# EAGLE design untitled (EAGLE 9.6.2)
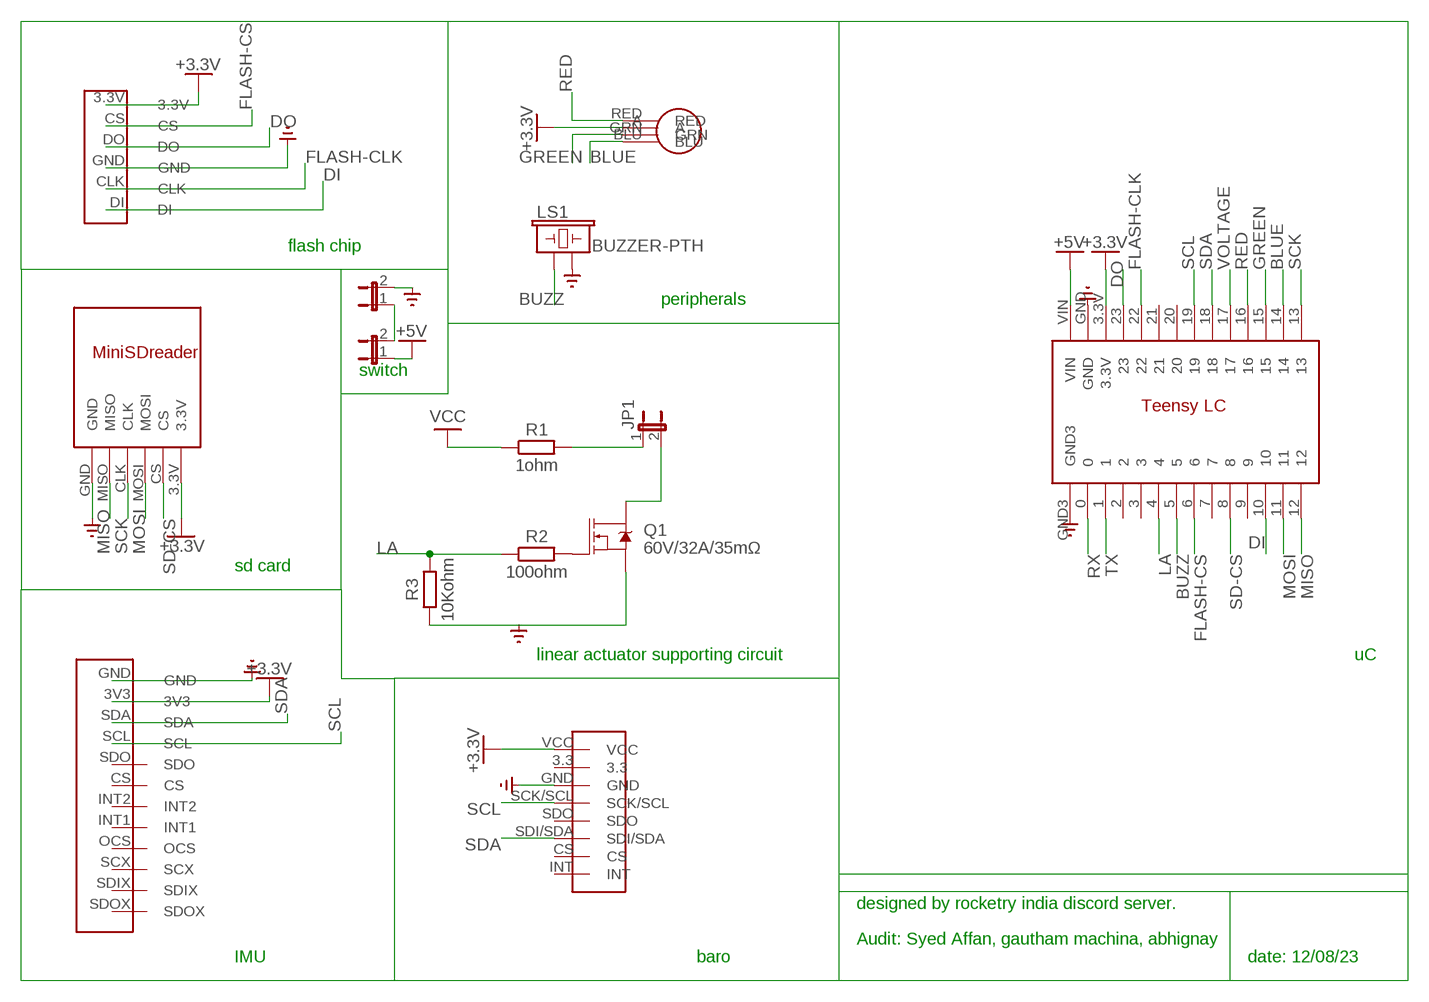
[diagram p0: schematic, sheet 1]

## Parts
JP1  JP1E  [JP1]
JP2  JP1E  [JP1]
JP3  JP1E  [JP1]
LS1  BUZZER-PTH  [BUZZER-12MM]
Q1  60V/32A/35mΩ  MOSFET-NCH-FQP30N06L  [TO220V]
R1  1ohm  R_AXIAL-7.2MM-PITCH  [RESAD724W46L381D178B]
R2  100ohm  R_AXIAL-7.2MM-PITCH  [RESAD724W46L381D178B]
R3  10Kohm  R_AXIAL-7.2MM-PITCH  [RESAD724W46L381D178B]
U$1  TEENSYLC  [TEENSYLC]
U$2  LED  [LED]
U$3  FLASH  [FLASH]
U$4  MINISDREADER  [MINISDREADER]
U$5  LSM6DSO  [LSM6DSO]
U$6  BMP390  [BMP390]

## Nets
+3.3V: U$1.3.3V U$2.A U$3.3.3V U$4.3.3V U$5.3V3 U$6.VCC
+5V: JP3.1 U$1.VIN
BLUE: U$1.14 U$2.BLU
BUZZ: LS1.+ U$1.5
DI: U$1.10 U$3.DI
DO: U$1.23 U$3.DO
FLASH-CLK: U$1.22 U$3.CLK
FLASH-CS: U$1.6 U$3.CS
GND: JP2.2 U$1.GND U$3.GND U$4.GND U$5.GND U$6.GND ; supply symbol labelled SUPPLY0_GND_
GREEN: U$1.15 U$2.GRN
LA: R2.1 R3.2 U$1.4
MISO: U$1.12 U$4.MISO
MOSI: U$1.11 U$4.MOSI
N$1: JP1.1 R1.2
N$2: JP1.2 Q1.2(D)
N$3: Q1.1(G) R2.2
N$5: Q1.3(S) R3.1
N$6: JP2.1 JP3.2
RED: U$1.16 U$2.RED
RX: U$1.0
SCK: U$1.13 U$4.CLK
SCL: U$1.19 U$5.SCL U$6.SCK/SCL
SD-CS: U$1.8 U$4.CS
SDA: U$1.18 U$5.SDA U$6.SDI/SDA
TX: U$1.1
VCC: R1.1
VOLTAGE: U$1.17
Unconnected: LS1.- U$1.2 U$1.3 U$1.7 U$1.9 U$1.20 U$1.21 U$1.GND3 U$5.CS U$5.INT1 U$5.INT2 U$5.OCS U$5.SCX U$5.SDIX U$5.SDO U$5.SDOX U$6.3.3 U$6.CS U$6.INT U$6.SDO

## Notes on the sheet
- flash chip
- peripherals
- switch
- sd card
- linear actuator supporting circuit | uC
- designed by rocketry india discord server.
- Audit: Syed Affan, gautham machina, abhignay
- IMU | baro | date: 12/08/23

## Library data of the parts
JP1-JP3 = jumper:JP1E: JUMPER
LS1 = SparkFun-Electromechanical:BUZZER: Buzzer Small round buzzers that operate around the audible 2kHz range. You can use these as speakers to create simple music or user interfaces. Variant Overview: PTH - Mini Speaker - PC Mount 12mm 2.048kHz <https://www.sparkfun.com/products/7950> PTH_KIT - Mini Speaker - PC Mount 12mm 2.048kHz <https://www.sparkfun.com/products/7950> KIT simplifies soldering by adding stop mask to one side of the pads. PTH_NO_SILK - Mini Speaker - PC Mount 12mm 2.048kHz <https://www.sparkfun.com/products/7950> No silkscreen indicator of buzzer outline. PTH_KIT_NO_SILK - Mini Speaker - PC Mount 12mm 2.048kHz <https://www.sparkfun.com/products/7950> KIT package w/o silkscreen SMD - Buzzer Audio Magnetic (CCV-084B16) SMD buzzer used on, e.g. the LilyPad Buzzer <https://www.sparkfun.com/products/8463> and RFID USB Reader <https://www.sparkfun.com/products/9963>. SMD_KIT - Buzzer Audio Magnetic (CCV-084B16) SMD Buzzer with elongated pins to make soldering easier. Used on the SparkFun Simon Says - Surface Mount Soldering Kit <https://www.sparkfun.com/products/10935>.; PROD_ID: COMP-08253; SF_SKU: COM-07950
Q1 = SparkFun-DiscreteSemi:MOSFET-NCH: N-channel MOSFETs Voltage controlled devices that allow control of high current outputs. SparkFun Products: SparkFun OpenScale <https://www.sparkfun.com/products/13261> SparkFun Digital Sandbox <https://www.sparkfun.com/products/12651> SparkFun Monster Moto Shield <https://www.sparkfun.com/products/10182> SparkFun MOSFET Power Controller <https://www.sparkfun.com/products/11214>; PROD_ID: TRANS-10060
R1-R3 = Resistor:R: Resistor Fixed - Generic; CATEGORY: Resistor; SUB-CATEGORY: Fixed
U$1 = Teensy lc:TEENSYLC
U$2 = led:LED
U$3 = flash:FLASH
U$4 = minisdreader:MINISDREADER
U$5 = LSM6DSO:LSM6DSO
U$6 = bmp390:BMP390

## Board
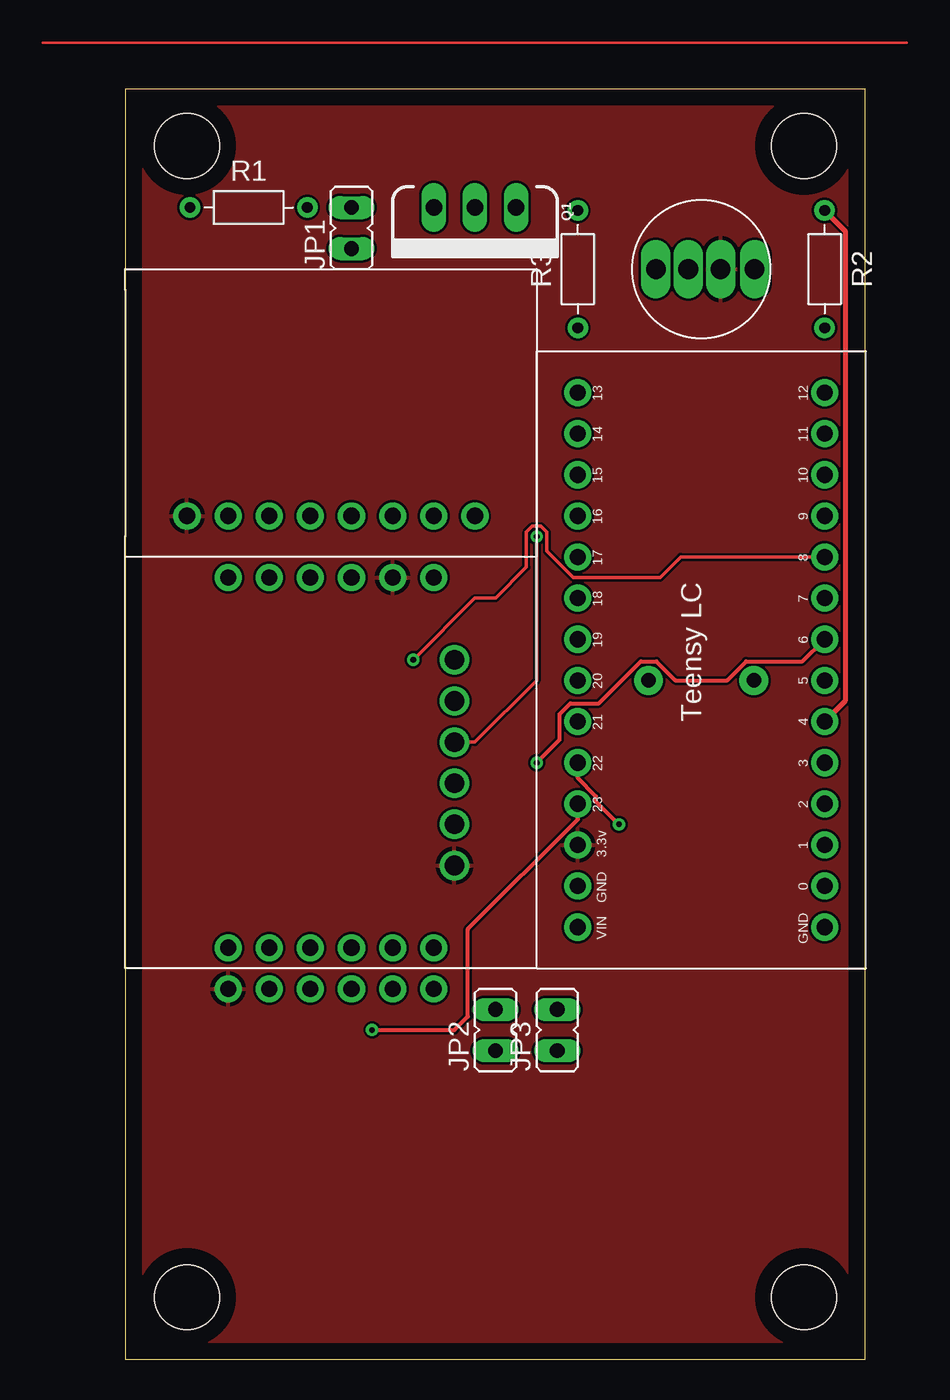
[diagram p1: board, top side]
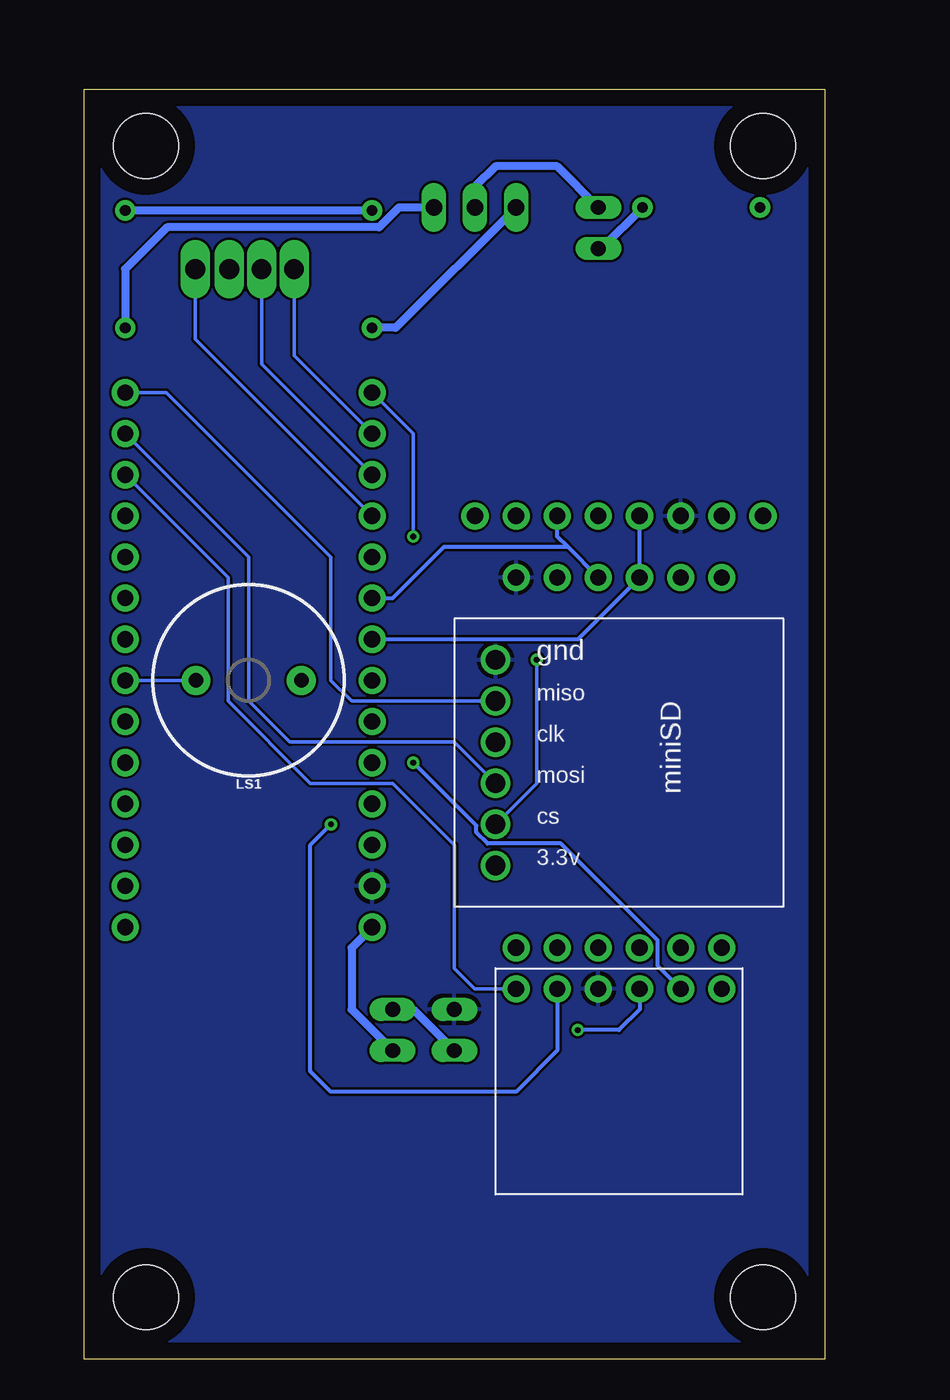
[diagram p2: board, bottom side, seen from below]

Size 45.7 x 78.41 mm. Coordinates in mm from the lower left corner, seen from the top.
Outline: 0,0 45.7,0 45.7,78.41 0,78.41 0,0
Copper layers (1*16): Top 0.035mm / dielectric 1.5mm / Bottom 0.035mm
Design rules "default": minimum track width 6mil, minimum drill 0.35mm, track to track 6mil, track to pad 6mil, pad to pad 6mil, via to via 6mil, smd to smd 6mil, copper to edge 40mil, drill to drill 6mil, minimum pad ring 10mil, minimum via ring 8mil, stop-mask expansion 4mil, vias tented up to drill 0mil, thermal gap 10mil
Holes 4 mm at 41.91,74.93 3.81,74.93 3.81,3.81 41.91,3.81

### Footprints (pad centres in the part's own frame; a part is rotated, then mirrored left to right if it is on the bottom)
JP1 = drill 0.914 long: 1 0,-1.27; 2 0,1.27
BUZZER-12MM = drill 0.9 pad 1.778: + 3.25,0; - -3.25,0
TO220V = drill 1.016 long: 1 -2.54,0; 2 0,0; 3 2.54,0
RESAD724W46L381D178B = drill 0.66 pad 1.26: 1 -3.62,0; 2 3.62,0
TEENSYLC = drill 1 pad 1.676: 0 5.08,0; 1 7.62,0; 2 10.16,0; 3 12.7,0; 3.3V 7.62,15.24; 4 15.24,0; 5 17.78,0; 6 20.32,0; 7 22.86,0; 8 25.4,0; 9 27.94,0; 10 30.48,0; 11 33.02,0; 12 35.56,0; 13 35.56,15.24; 14 33.02,15.24; 15 30.48,15.24; 16 27.94,15.24; 17 25.4,15.24; 18 22.86,15.24; 19 20.32,15.24; 20 17.78,15.24; 21 15.24,15.24; 22 12.7,15.24; 23 10.16,15.24; GND 5.08,15.24; GND3 2.54,0; VIN 2.54,15.24
LED = drill 1.212 pad 1.422 long: A -1.2,0; BLU 2.8,0; GRN 0.8,0; RED -3.3,0
FLASH = drill 1 pad 1.676: 3.3V 1.27,13.97; CLK 1.27,3.81; CS 1.27,11.43; DI 1.27,1.27; DO 1.27,8.89; GND 1.27,6.35
MINISDREADER = drill 1.212 pad 1.411: 3.3V 15.24,-17.78; CLK 7.62,-17.78; CS 12.7,-17.78; GND 2.54,-17.78; MISO 5.08,-17.78; MOSI 10.16,-17.78
LSM6DSO = drill 1 pad 1.676: 3V3 8.89,1.27; CS 19.05,1.27; GND 6.35,1.27; INT1 8.89,24.13; INT2 6.35,24.13; OCS 11.43,24.13; SCL 13.97,1.27; SCX 13.97,24.13; SDA 11.43,1.27; SDIX 16.51,24.13; SDO 16.51,1.27; SDOX 19.05,24.13
BMP390 = drill 1 pad 1.676: 3.3 6.35,-15.24; CS 19.05,-15.24; GND 8.89,-15.24; INT 21.59,-15.24; SCK/SCL 11.43,-15.24; SDI/SDA 16.51,-15.24; SDO 13.97,-15.24; VCC 3.81,-15.24

### Placement (x,y rotation side)
JP1  13.97,69.85 0 top
JP2  22.86,20.32 0 top
JP3  26.67,20.32 0 top
LS1  35.56,41.91 180 bottom
Q1  21.59,71.12 180 top
R1  7.62,71.12 0 top
R2  43.18,67.31 270 top
R3  27.94,67.31 90 top
U$1  43.18,24.13 90 top
U$2  35.56,67.31 180 top
U$3  20.32,24.13 270 bottom
U$4  2.54,45.72 270 bottom
U$5  25.4,49.53 180 top
U$6  0,67.31 0 top

### Tracks (layer width: path | path; a pad name or v marks a point on that pad's centre or on a via)
+3.3V
  pour Top: -5.08,80.01 48.26,80.01 48.26,-2.54 46.99,-3.81 -5.08,-3.81
+5V
  Bottom 0.508: U$1.VIN 29.21,25.4 29.21,21.59 JP3.1
BLUE
  Bottom 0.203: U$1.14 32.76,61.97 U$2.BLU
BUZZ
  Bottom 0.203: LS1.+ U$1.5
DI
  Bottom 0.203: U$1.10 36.83,48.26 36.83,40.64 31.75,35.56 26.67,35.56 22.86,31.75 22.86,24.13 21.59,22.86 U$3.DI
DO  (via drill 0.35)
  Top 0.254: v15.24,20.32 20.32,20.32 21.16,21.16 21.16,26.55 27.94,33.33 U$1.23
  Bottom 0.254: U$3.DO 11.43,21.59 12.7,20.32 v15.24,20.32
FLASH-CLK  (via drill 0.35)
  Top 0.254: v30.48,33.02 29.06,34.44 29.06,34.75 27.94,35.87 U$1.22
  Bottom 0.254: U$3.CLK 16.51,19.05 19.05,16.51 30.48,16.51 31.75,17.78 31.75,31.75 v30.48,33.02
FLASH-CS  (via drill 0.35)
  Top 0.254: v25.4,36.83 26.82,38.25 26.82,39.83 27.48,40.49 29.23,40.49 31.83,43.08 32.79,43.08 33.96,41.91 37.16,41.91 38.33,43.08 41.81,43.08 U$1.6
  Bottom 0.254: U$3.CS 10.31,24.28 10.31,25.86 16.28,31.83 20.81,31.83 21.51,32.53 21.51,32.94 v25.4,36.83
GND
  pour Bottom: -2.54,78.74 -2.54,-3.81 48.26,-3.81 48.26,78.74
GREEN
  Bottom 0.203: U$1.15 34.76,61.43 U$2.GRN
LA
  Top 0.305: R2.1 44.45,69.66 44.45,40.64 U$1.4
  Bottom 0.508: R3.2 R2.1
MISO
  Bottom 0.203: U$4.MISO 29.21,40.64 30.48,41.91 30.48,49.53 40.64,59.69 U$1.12
MOSI
  Bottom 0.203: U$4.MOSI 22.86,38.1 33.02,38.1 35.56,40.64 35.56,49.53 U$1.11
N$1
  Bottom 0.508: R1.2 13.78,68.58 JP1.1
N$2
  Bottom 0.508: JP1.2 16.51,73.66 20.32,73.66 21.59,72.39 Q1.2
N$3
  Bottom 0.508: Q1.1 26.28,71.12 27.51,69.89 40.6,69.89 43.18,67.31 R2.2
N$4
  Top 0.152: -5.08,81.28 48.26,81.28
N$5
  Bottom 0.508: Q1.3 26.48,63.69 R3.1
N$6
  Bottom 0.508: JP2.1 25.4,21.59 JP3.2
RED
  Bottom 0.203: U$2.RED 38.86,62.99 U$1.16
SCK  (via drill 0.35)
  Top 0.203: v25.4,50.8 25.4,41.91 21.59,38.1 U$4.CLK
  Bottom 0.203: U$1.13 25.4,57.15 v25.4,50.8
SCL
  Bottom 0.254: U$6.SCK/SCL U$5.SCL 15.24,44.45 U$1.19
SD-CS  (via drill 0.35)
  Top 0.203: v17.78,43.18 21.59,46.99 22.86,46.99 24.77,48.9 24.77,51.06 25.14,51.43 25.66,51.43 26.03,51.06 26.03,49.89 27.66,48.26 33.02,48.26 34.29,49.53 U$1.8
  Bottom 0.203: U$4.CS 17.78,35.56 v17.78,43.18
SDA
  Bottom 0.254: U$5.SDA 15.88,50.16 | 15.88,50.16 16.51,50.8 U$6.SDI/SDA | U$1.18 26.67,46.99 23.49,50.16 15.88,50.16